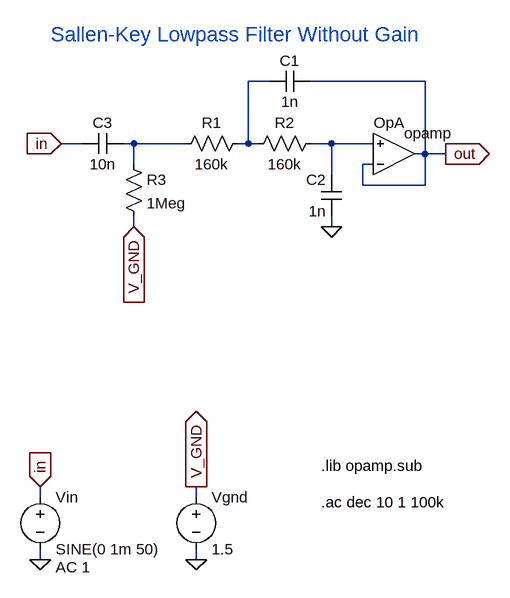
[diagram p0: schematic SK_lowpass.asc]
SK_lowpass.asc, the LTspice schematic file:
Version 4
SHEET 1 880 680
WIRE 256 -192 224 -192
WIRE 496 -192 320 -192
WIRE -32 -96 -64 -96
WIRE 48 -96 32 -96
WIRE 128 -96 48 -96
WIRE 224 -96 224 -192
WIRE 224 -96 208 -96
WIRE 240 -96 224 -96
WIRE 352 -96 320 -96
WIRE 416 -96 352 -96
WIRE 496 -80 496 -192
WIRE 496 -80 480 -80
WIRE 528 -80 496 -80
WIRE 48 -64 48 -96
WIRE 416 -64 400 -64
WIRE 352 -48 352 -96
WIRE 400 -32 400 -64
WIRE 496 -32 496 -80
WIRE 496 -32 400 -32
WIRE 48 32 48 16
WIRE 352 32 352 16
WIRE -96 448 -96 432
WIRE 144 448 144 432
WIRE -96 544 -96 528
WIRE 144 544 144 528
FLAG -96 544 0
FLAG -96 432 in
IOPIN -96 432 In
FLAG 48 32 V_GND
IOPIN 48 32 In
FLAG -64 -96 in
IOPIN -64 -96 In
FLAG 528 -80 out
IOPIN 528 -80 Out
FLAG 144 544 0
FLAG 144 432 V_GND
IOPIN 144 432 Out
FLAG 352 32 0
SYMBOL OpAmps\\opamp 448 -16 M180
WINDOW 0 -31 112 Left 2
SYMATTR InstName OpA
SYMBOL voltage -96 432 R0
WINDOW 123 24 124 Left 2
WINDOW 39 0 0 Left 0
SYMATTR Value2 AC 1
SYMATTR InstName Vin
SYMATTR Value SINE(0 1m 50)
SYMBOL cap 32 -112 R90
WINDOW 0 0 32 VBottom 2
WINDOW 3 32 32 VTop 2
SYMATTR InstName C3
SYMATTR Value 10n
SYMBOL voltage 144 432 R0
WINDOW 123 24 124 Left 2
WINDOW 39 0 0 Left 0
SYMATTR InstName Vgnd
SYMATTR Value 1.5
SYMBOL res 224 -112 R90
WINDOW 0 0 56 VBottom 2
WINDOW 3 32 56 VTop 2
SYMATTR InstName R1
SYMATTR Value 160k
SYMBOL res 336 -112 R90
WINDOW 0 0 56 VBottom 2
WINDOW 3 32 56 VTop 2
SYMATTR InstName R2
SYMATTR Value 160k
SYMBOL cap 320 -208 R90
WINDOW 0 0 32 VBottom 2
WINDOW 3 32 32 VTop 2
SYMATTR InstName C1
SYMATTR Value 1n
SYMBOL cap 368 16 R180
WINDOW 0 24 56 Left 2
WINDOW 3 24 8 Left 2
SYMATTR InstName C2
SYMATTR Value 1n
SYMBOL res 32 -80 R0
SYMATTR InstName R3
SYMATTR Value 1Meg
TEXT 336 400 Left 2 !.lib opamp.sub
TEXT 336 456 Left 2 !.ac dec 10 1 100k
TEXT -80 -264 Left 3 ;Sallen-Key Lowpass Filter Without Gain

The netlist it stands for:
* SK_lowpass.asc
XOpA out N003 out opamp Aol=100K GBW=10Meg  ; pins invin noninvin out
Vin in 0 SINE(0 1m 50) AC 1
C3 N002 in 10n
Vgnd V_GND 0 1.5
R1 N001 N002 160k
R2 N003 N001 160k
C1 out N001 1n
C2 0 N003 1n
R3 N002 V_GND 1Meg
.lib opamp.sub
.ac dec 10 1 100k
* Sallen-Key Lowpass Filter Without Gain
.backanno
.end